# Altium schematic sheet SCH_3.3v_regulator.SchDoc
size A; SheetNumber: 1; SheetTotal: 6
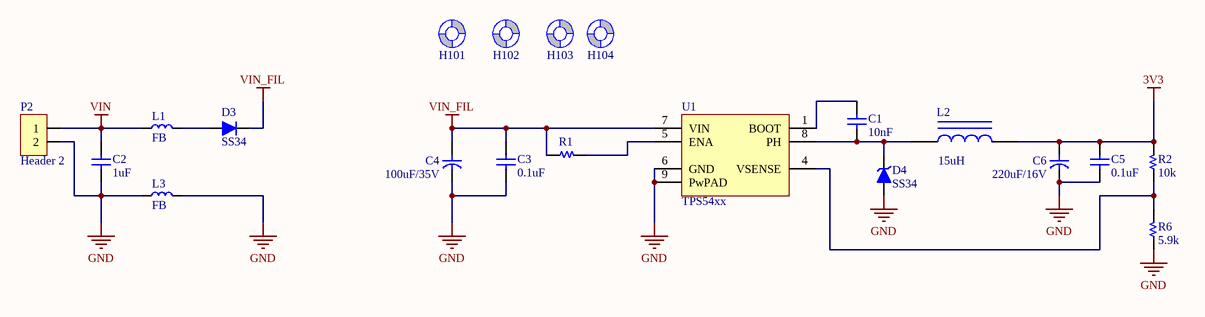
[diagram p0: SCH_3.3v_regulator.SchDoc]

## Parts
C1  10nF  [C 0805]
C2  1uF  [C 0805]
C3  0.1uF  [C 0805]
C4  100uF/35V  [C SMD ALU (D8)]
C5  0.1uF  [C 0805]
C6  220uF/16V  [C SMD ALU (D8)]
D3  SS34  [Diode PowerDI123]
D4  SS34  [DO-214AC (SMA)]
H101  Screw Hole  [SCREW/3.2/7.0/M]  (value not drawn)  (no BOM)
H102  Screw Hole  [SCREW/3.2/7.0/M]  (value not drawn)  (no BOM)
H103  Screw Hole  [SCREW/3.2/7.0/M]  (value not drawn)  (no BOM)
H104  Screw Hole  [SCREW/3.2/7.0/M]  (value not drawn)  (no BOM)
L1  FB  [L 0805 (2012)]
L2  15uH  [AXIAL-0.9]
L3  FB  [L 0805 (2012)]
P2  Header 2  [HDR/Header/2/BOX]
R1  R  [R 0805]  (value not drawn)
R2  10k  [R 0805]
R6  5.9k  [R 0805]
U1  TPS54xx  [SOIC-8 EP]

## Nets
3V3: C5.1 C6.1 L2.2 R2.2
GND: C2.2 C3.2 C4.2 C5.2 C6.2 D4.1(A) L3.1 L3.2 P2.2 R6.1 U1.6(GND) U1.9(PwPAD)
VIN: C2.1 L1.1 P2.1
VIN_FIL: C3.1 C4.1 D3.2(K) R1.1 U1.7(VIN)
NetC1_1: C1.1 U1.1(BOOT)
NetC1_2: C1.2 D4.2(K) L2.1 U1.8(PH)
NetD3_1: D3.1(A) L1.2
NetR1_2: R1.2 U1.5(ENA)
NetR2_1: R2.1 R6.2 U1.4(VSENSE)

Not connected (* = marked no-connect by the designer): H101 1(Screw); H102 1(Screw); H103 1(Screw); H104 1(Screw)

## Library data of the parts
C1-C3 C5 = Capacitor NP: Capacitor non-pol
C4 C6 = Capacitor: Capacitor pol
D3 = Diode: Default Diode
D4 = Diode Zener: Zener Diode
L1 L3 = Inductor
L2 = Inductor Iron: Magnetic-Core Inductor; Published: 24-Mar-1999; LatestRevisionDate: 17-Jul-2002; LatestRevisionNote: Re-released for DXP Platform.; PackageReference: AXIAL-0.9; Publisher: Altium Limited; PackageDescription: Axial Device, Thru-Hole; 2 Leads; 0.9 in Pin Spacing; Value: 15uH
P2 = Header 2: Header, 2-Pin
R1 R2 R6 = Resistor
U1 = TPS54xx: 3/5A, Wide input range, Step-down SWIFT DC-DC Converter
H101-H104 = Screw Hole: TYPE: NO-BOM; UNIT PRICE: 0